# EAGLE design zumo_lidar_01 (EAGLE 9.5.2)
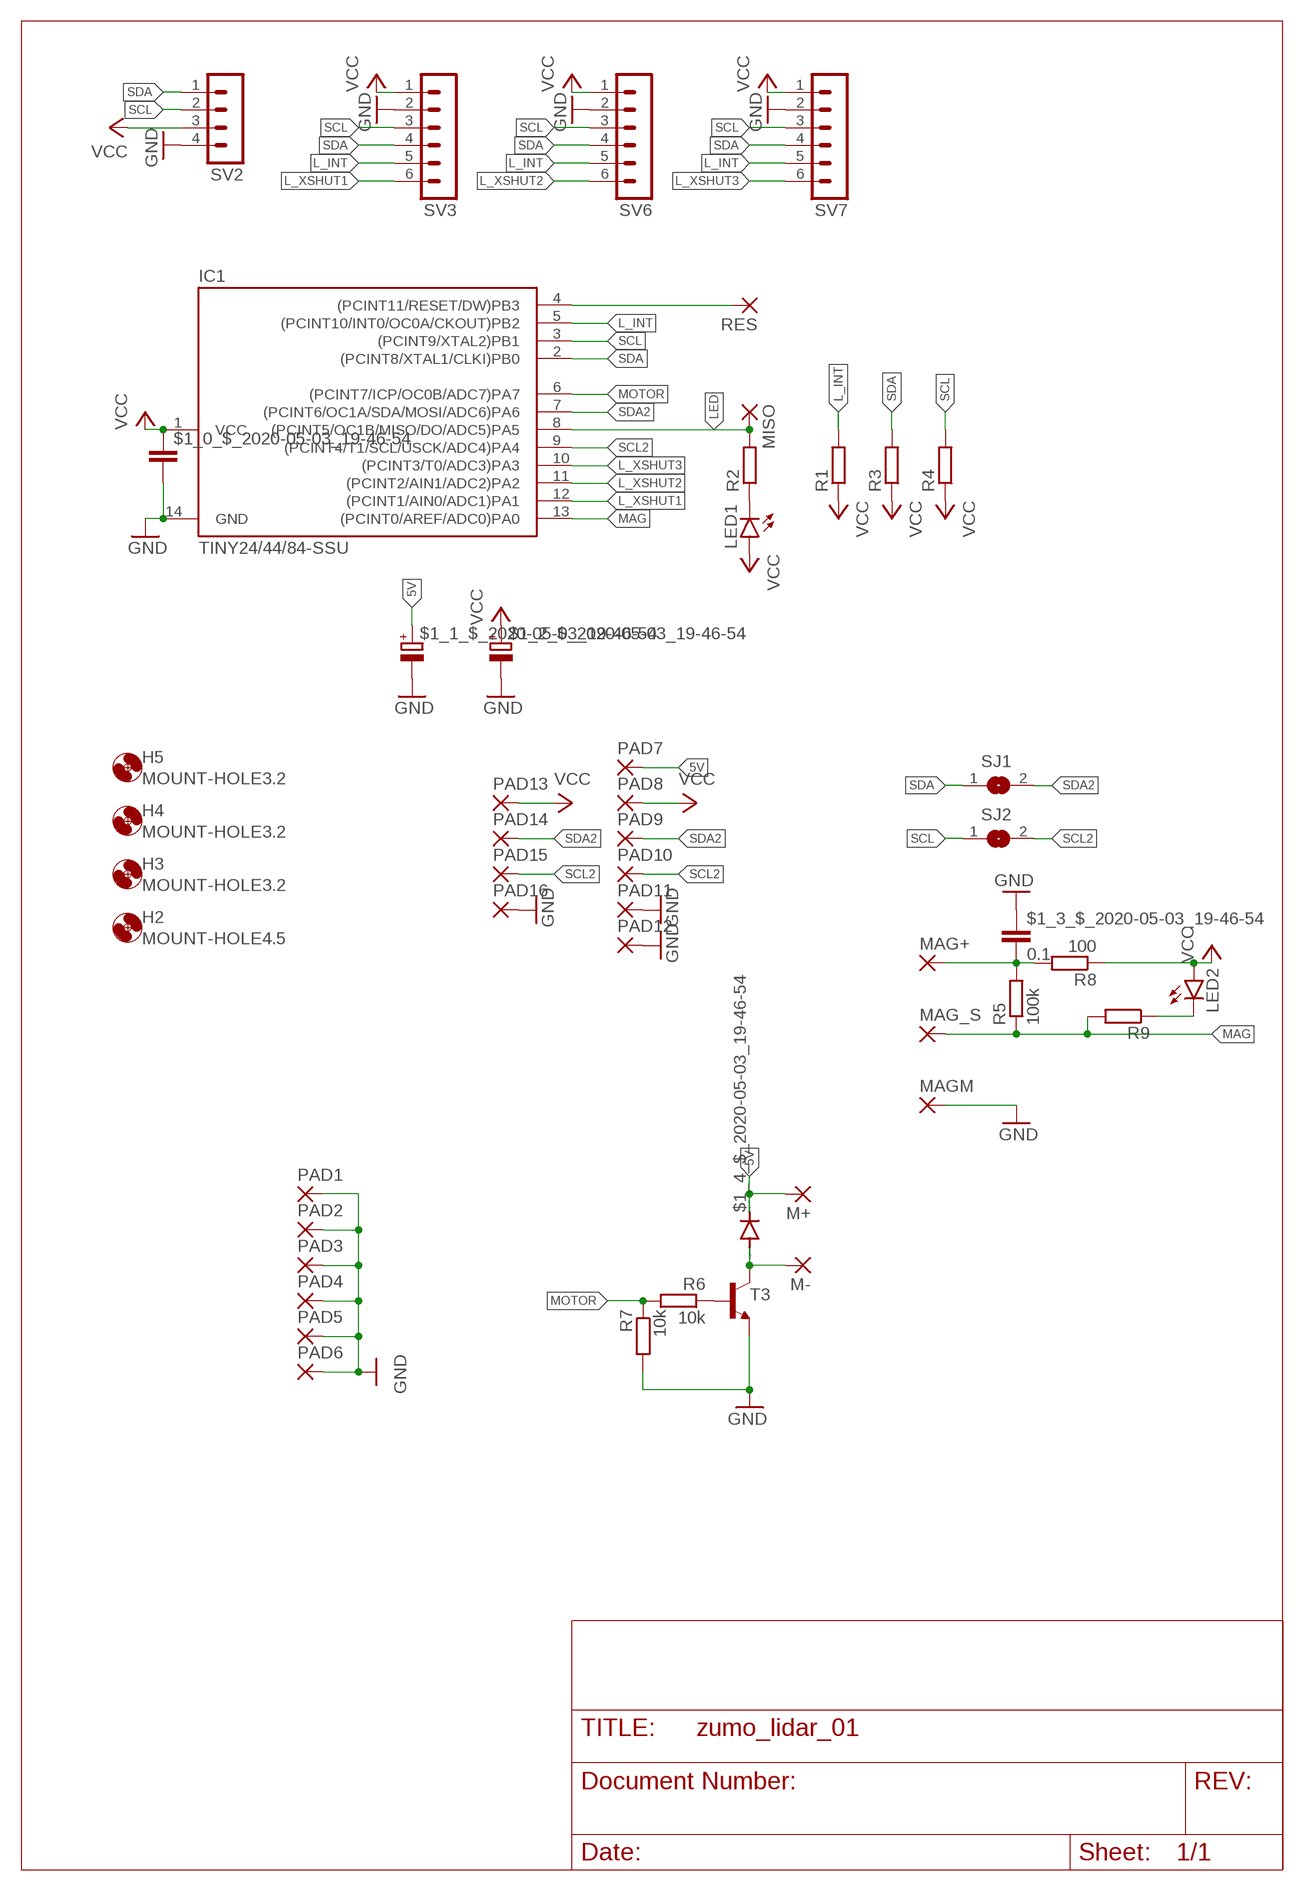
[diagram p0: schematic, sheet 1]

## Parts
$1_0_$_2020-05-03_19-46-54  C-EUC0805  [C0805]
$1_1_$_2020-05-03_19-46-54  CPOL-EUSMCC  [SMC_C]
$1_2_$_2020-05-03_19-46-54  CPOL-EUSMCC  [SMC_C]
$1_3_$_2020-05-03_19-46-54  0.1  C-EUC0805  [C0805]
$1_4_$_2020-05-03_19-46-54  DIODE-MINIMELF  [MINIMELF]
H2  MOUNT-HOLE4.5  [4,5]
H3  MOUNT-HOLE3.2  [3,2]
H4  MOUNT-HOLE3.2  [3,2]
H5  MOUNT-HOLE3.2  [3,2]
IC1  TINY24/44/84-SSU  [SOIC14]
LED1  LEDSML0805  [SML0805]
LED2  LEDSML0805  [SML0805]
M+  1,6/0,8  [1,6/0,8]
M-  1,6/0,8  [1,6/0,8]
MAG+  1,6/0,8  [1,6/0,8]
MAG_S  1,6/0,8  [1,6/0,8]
MAGM  1,6/0,8  [1,6/0,8]
MISO  1,6/0,8  [1,6/0,8]
PAD1  2,54/1,1  [2,54/1,1]
PAD2  2,54/1,1  [2,54/1,1]
PAD3  2,54/1,1  [2,54/1,1]
PAD4  2,54/1,1  [2,54/1,1]
PAD5  2,54/1,1  [2,54/1,1]
PAD6  2,54/1,1  [2,54/1,1]
PAD7  1,6/0,8  [1,6/0,8]
PAD8  1,6/0,8  [1,6/0,8]
PAD9  1,6/0,8  [1,6/0,8]
PAD10  1,6/0,8  [1,6/0,8]
PAD11  1,6/0,8  [1,6/0,8]
PAD12  1,6/0,8  [1,6/0,8]
PAD13  1,6/0,8  [1,6/0,8]
PAD14  1,6/0,8  [1,6/0,8]
PAD15  1,6/0,8  [1,6/0,8]
PAD16  1,6/0,8  [1,6/0,8]
R1  R-EU_M0805  [M0805]
R2  R-EU_M0805  [M0805]
R3  R-EU_M0805  [M0805]
R4  R-EU_M0805  [M0805]
R5  100k  R-EU_M0805  [M0805]
R6  10k  R-EU_R0805  [R0805]
R7  10k  R-EU_R0805  [R0805]
R8  100  R-EU_M0805  [M0805]
R9  R-EU_M0805  [M0805]
RES  1,6/0,8  [1,6/0,8]
SJ1  SJ  [SJ]
SJ2  SJ  [SJ]
SV2  MA04-1  [MA04-1]
SV3  MA06-1  [MA06-1]
SV6  MA06-1  [MA06-1]
SV7  MA06-1  [MA06-1]
T3  BC817-16-NPN-SOT23-BEC  [SOT23-BEC]

## Nets
5V: $1_1_$_2020-05-03_19-46-54.+ $1_4_$_2020-05-03_19-46-54.C M+.1(P) PAD7.1(P)
GND [gnd]: $1_0_$_2020-05-03_19-46-54.2 $1_1_$_2020-05-03_19-46-54.- $1_2_$_2020-05-03_19-46-54.- $1_3_$_2020-05-03_19-46-54.1 IC1.14(GND) MAGM.1(P) PAD1.1(P) PAD2.1(P) PAD3.1(P) PAD4.1(P) PAD5.1(P) PAD6.1(P) PAD11.1(P) PAD12.1(P) PAD16.1(P) R7.2 SV2.4 SV3.2 SV6.2 SV7.2 T3.E
L_INT: IC1.5((PCINT10/INT0/OC0A/CKOUT)PB2) R1.2 SV3.5 SV6.5 SV7.5
L_XSHUT1: IC1.12((PCINT1/AIN0/ADC1)PA1) SV3.6
L_XSHUT2: IC1.11((PCINT2/AIN1/ADC2)PA2) SV6.6
L_XSHUT3: IC1.10((PCINT3/T0/ADC3)PA3) SV7.6
LED: IC1.8((PCINT5/OC1B/MISO/DO/ADC5)PA5) MISO.1(P) R2.2
MAG: IC1.13((PCINT0/AREF/ADC0)PA0) MAG_S.1(P) R5.1 R9.2
MAGVCC: $1_3_$_2020-05-03_19-46-54.2 MAG+.1(P) R5.2 R8.2
MOTOR: IC1.6((PCINT7/ICP/OC0B/ADC7)PA7) R6.2 R7.1
N$1: LED1.C R2.1
N$2: $1_4_$_2020-05-03_19-46-54.A M-.1(P) T3.C
N$3: R6.1 T3.B
N$4: LED2.C R9.1
RESET: IC1.4((PCINT11/RESET/DW)PB3) RES.1(P)
SCL: IC1.3((PCINT9/XTAL2)PB1) R4.2 SJ2.1 SV2.2 SV3.3 SV6.3 SV7.3
SCL2: IC1.9((PCINT4/T1/SCL/USCK/ADC4)PA4) PAD10.1(P) PAD15.1(P) SJ2.2
SDA: IC1.2((PCINT8/XTAL1/CLKI)PB0) R3.2 SJ1.1 SV2.1 SV3.4 SV6.4 SV7.4
SDA2: IC1.7((PCINT6/OC1A/SDA/MOSI/ADC6)PA6) PAD9.1(P) PAD14.1(P) SJ1.2
VCC: $1_0_$_2020-05-03_19-46-54.1 $1_2_$_2020-05-03_19-46-54.+ IC1.1(VCC) LED1.A LED2.A PAD8.1(P) PAD13.1(P) R1.1 R3.1 R4.1 R8.1 SV2.3 SV3.1 SV6.1 SV7.1

## Library data of the parts
$1_0_$_2020-05-03_19-46-54 $1_3_$_2020-05-03_19-46-54 = rcl:C-EU: CAPACITOR, European symbol; SPICEPREFIX: C
$1_1_$_2020-05-03_19-46-54 $1_2_$_2020-05-03_19-46-54 = rcl:CPOL-EU: POLARIZED CAPACITOR, European symbol; SPICEPREFIX: C
$1_4_$_2020-05-03_19-46-54 = diode:DIODE-: DIODE
H2-H5 = holes:MOUNT-HOLE: MOUNTING HOLE with drill center marker
IC1 = avr-7:TINY24/44/84
LED1 LED2 = led:LED: LED OSRAM: - CHIPLED LG R971, LG N971, LY N971, LG Q971, LY Q971, LO R971, LY R971 LH N974, LH R974 LS Q976, LO Q976, LY Q976 LO Q996 - Hyper CHIPLED LW Q18S LB Q993, LB Q99A, LB R99A - SideLED LS A670, LO A670, LY A670, LG A670, LP A670 LB A673, LV A673, LT A673, LW A673 LH A674 LY A675 LS A676, LA A676, LO A676, LY A676, LW A676 LS A679, LY A679, LG A679 - Hyper Micro SIDELED® LS Y876, LA Y876, LO Y876, LY Y876 LT Y87S - SmartLED LW L88C, LW L88S LB L89C, LB L89S, LG L890 LS L89K, LO L89K, LY L89K LS L896, LA L896, LO L896, LY L896 - TOPLED LS T670, LO T670, LY T670, LG T670, LP T670 LSG T670, LSP T670, LSY T670, LOP T670, LYG T670 LG T671, LOG T671, LSG T671 LB T673, LV T673, LT T673, LW T673 LH T674 LS T676, LA T676, LO T676, LY T676, LB T676, LH T676, LSB T676, LW T676 LB T67C, LV T67C, LT T67C, LS T67K, LO T67K, LY T67K, LW E67C LS E67B, LA E67B, LO E67B, LY E67B, LB E67C, LV E67C, LT E67C LW T67C LS T679, LY T679, LG T679 LS T770, LO T770, LY T770, LG T770, LP T770 LB T773, LV T773, LT T773, LW T773 LH T774 LS E675, LA E675, LY E675, LS T675 LS T776, LA T776, LO T776, LY T776, LB T776 LHGB T686 LT T68C, LB T68C - Hyper Mini TOPLED® LB M676 - Mini TOPLED Santana® LG M470 LS M47K, LO M47K, LY M47K Source: http://www.osram.convergy.de LUXEON: - LUMILED® LXK2-PW12-R00, LXK2-PW12-S00, LXK2-PW14-U00, LXK2-PW14-V00 LXK2-PM12-R00, LXK2-PM12-S00, LXK2-PM14-U00 LXK2-PE12-Q00, LXK2-PE12-R00, LXK2-PE12-S00, LXK2-PE14-T00, LXK2-PE14-U00 LXK2-PB12-K00, LXK2-PB12-L00, LXK2-PB12-M00, LXK2-PB14-N00, LXK2-PB14-P00, LXK2-PB14-Q00 LXK2-PR12-L00, LXK2-PR12-M00, LXK2-PR14-Q00, LXK2-PR14-R00 LXK2-PD12-Q00, LXK2-PD12-R00, LXK2-PD12-S00 LXK2-PH12-R00, LXK2-PH12-S00 LXK2-PL12-P00, LXK2-PL12-Q00, LXK2-PL12-R00 Source: www.luxeon.com KINGBRIGHT: KA-3528ASYC Source: www.kingbright.com
M+ M- MAG+ MAG_S MAGM MISO PAD7-PAD16 RES = wirepad:1,6/0,8: THROUGH-HOLE PAD
PAD1-PAD6 = wirepad:2,54/1,1: THROUGH-HOLE PAD
R1-R5 R8 R9 = rcl:R-EU_: RESISTOR, European symbol; SPICEPREFIX: R
R6 R7 = rcl:R-EU_: RESISTOR, European symbol
SJ1 SJ2 = jumper:SJ: SMD solder JUMPER
SV2 = con-lstb:MA04-1: PIN HEADER; OC_FARNELL: unknown; OC_NEWARK: unknown
SV3 SV6 SV7 = con-lstb:MA06-1: PIN HEADER; OC_FARNELL: unknown; OC_NEWARK: unknown
T3 = transistor:*-NPN-: NPN Transistror BF959 corrected 2008.03.06

## Net classes
1 gnd: width 0.381 mm, drill 0.381 mm
2 power: width 0.381 mm, drill 0.381 mm

## Board
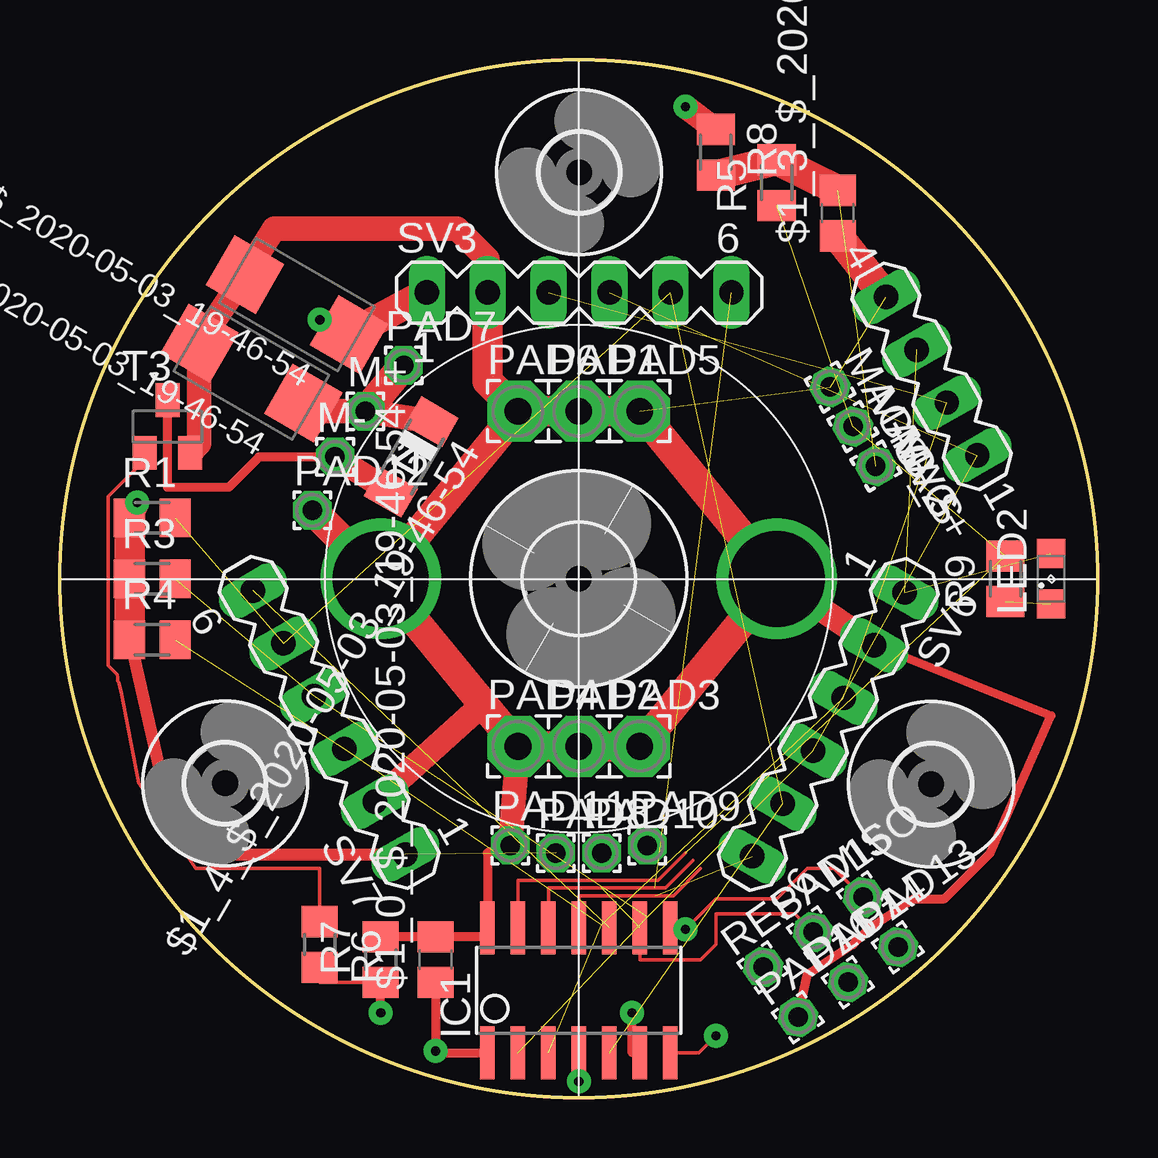
[diagram p1: board, top side]
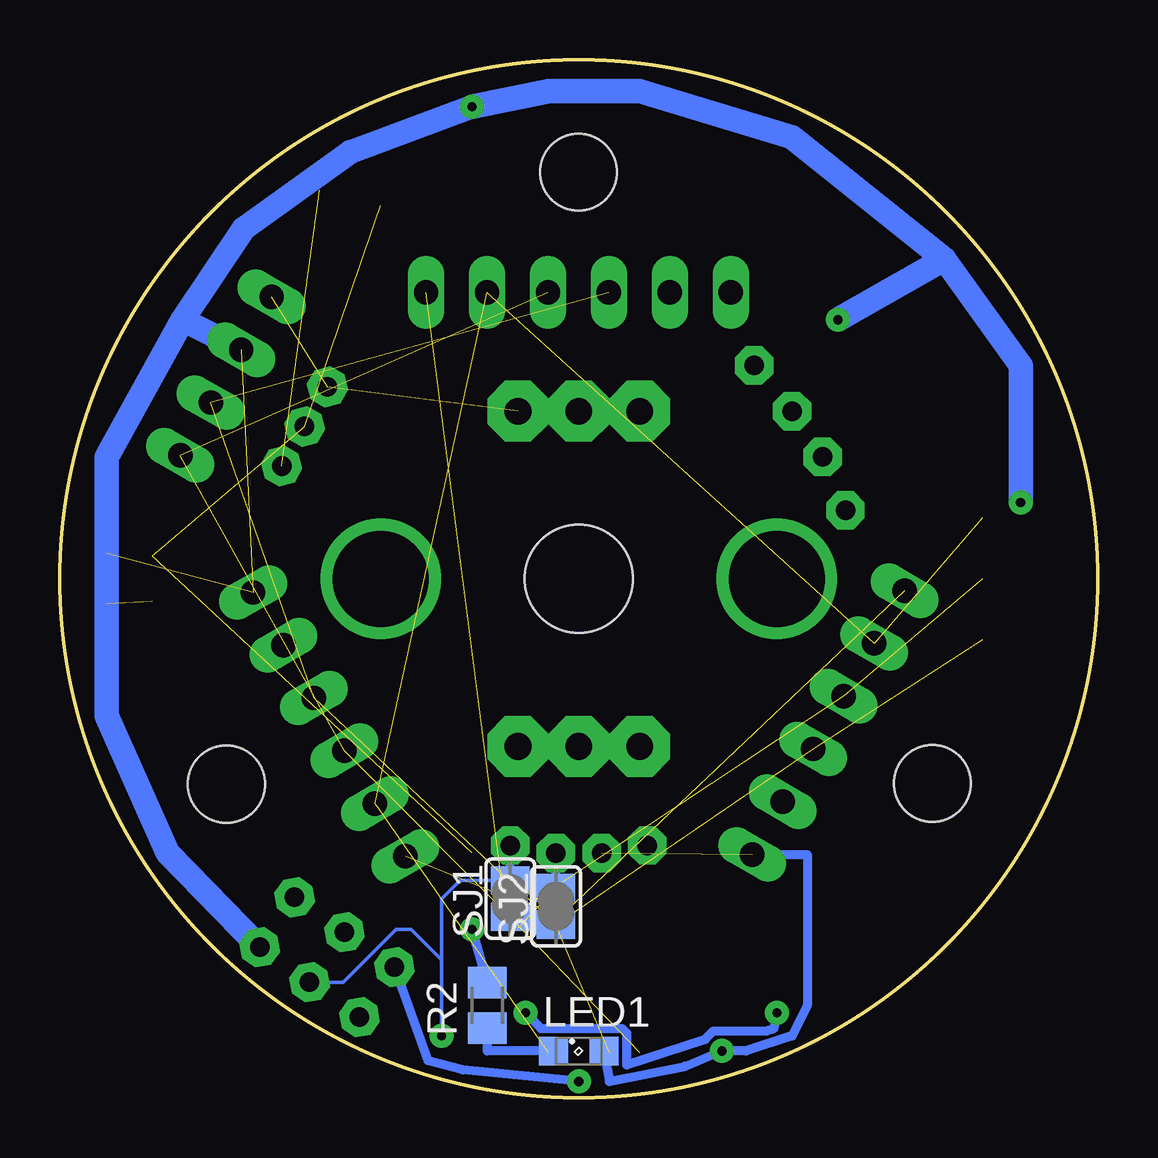
[diagram p2: board, bottom side, seen from below]

Size 43.25 x 43.25 mm. Coordinates in mm from the lower left corner, seen from the top.
Outline: circle at 21.63,21.63 radius 21.63
Copper layers (1*16): Top 0.035mm / dielectric 1.5mm / Bottom 0.035mm
Design rules "eagle": minimum track width 5mil, minimum drill 12mil, track to track 6mil, track to pad 6mil, pad to pad 6mil, via to via 6mil, smd to smd 0mil, copper to edge 10mil, drill to drill 10mil, minimum pad ring 10mil, minimum via ring 6mil, stop-mask expansion 2mil, vias tented up to drill 25mil, thermal gap 10mil

### Footprints (pad centres in the part's own frame; a part is rotated, then mirrored left to right if it is on the bottom)
C0805 = smd 1.3 x 1.5: 1 -0.95,0; 2 0.95,0
SMC_C = smd 2.4 x 2.4: + -2.5,0; - 2.5,0
MINIMELF = smd 1.4 x 1.8: A 1.7,0; C -1.7,0
4,5 = hole 4.5: 0,0
3,2 = hole 3.2: 0,0
SOIC14 = smd 0.61 x 2.21: 1 -3.81,-2.603; 2 -2.54,-2.603; 3 -1.27,-2.603; 4 0,-2.603; 5 1.27,-2.603; 6 2.54,-2.603; 7 3.81,-2.603; 8 3.81,2.603; 9 2.54,2.603; 10 1.27,2.603; 11 0,2.603; 12 -1.27,2.603; 13 -2.54,2.603; 14 -3.81,2.603
SML0805 = smd 1.2 x 1.2: A 1.05,0; C -1.05,0
1,6/0,8 = drill 0.813 pad 1.6 octagon: 1 0,0
2,54/1,1 = drill 1.118 pad 2.54 octagon: 1 0,0
M0805 = smd 1.3 x 1.6: 1 -0.95,0; 2 0.95,0
R0805 = smd 1.3 x 1.5: 1 -0.95,0; 2 0.95,0
SJ = smd 1.168 x 1.6: 1 -0.762,0; 2 0.762,0
MA04-1 = drill 1.016 long: 1 -3.81,0; 2 -1.27,0; 3 1.27,0; 4 3.81,0
MA06-1 = drill 1.016 long: 1 -6.35,0; 2 -3.81,0; 3 -1.27,0; 4 1.27,0; 5 3.81,0; 6 6.35,0
SOT23-BEC = smd 1 x 1.4: B -0.95,-1.1; C 0,1.1; E 0.95,-1.1

### Placement (x,y rotation side)
$1_0_$_2020-05-03_19-46-54  15.66,5.75 90 top
$1_1_$_2020-05-03_19-46-54  7.97,30.2 150 top
$1_2_$_2020-05-03_19-46-54  9.88,33.06 150 top
$1_3_$_2020-05-03_19-46-54  32.42,36.87 90 top
$1_4_$_2020-05-03_19-46-54  14.64,26.71 240 top
H2  21.63,21.63 60 top
H3  21.64,38.57 0 top
H4  36.32,13.07 0 top
H5  6.88,13.1 0 top
IC1  21.63,4.48 0 top
LED1  21.63,1.94 0 bottom
LED2  41.31,21.63 90 top
M+  12.74,28.61 0 top
M-  11.47,26.71 0 top
MAG+  34.01,26.33 300 top
MAG_S  33.06,27.98 300 top
MAGM  32.1,29.63 300 top
MISO  33.47,8.35 35 top
PAD1  21.63,28.61 0 top
PAD2  21.63,14.64 0 top
PAD3  24.17,14.64 0 top
PAD4  19.09,14.64 0 top
PAD5  24.17,28.61 0 top
PAD6  19.09,28.61 0 top
PAD7  14.32,30.52 0 top
PAD8  20.67,10.2 0 top
PAD9  24.48,10.51 0 top
PAD10  22.58,10.2 0 top
PAD11  18.77,10.51 0 top
PAD12  10.51,24.48 0 top
PAD13  34.93,6.27 35 top
PAD14  32.85,4.81 35 top
PAD15  31.39,6.89 35 top
PAD16  30.77,3.36 35 top
R1  3.85,24.17 0 top
R2  25.44,3.85 90 bottom
R3  3.85,21.63 0 top
R4  3.85,19.09 0 top
R5  29.88,38.14 90 top
R6  10.83,6.39 270 top
R7  13.37,5.75 90 top
R8  27.34,39.41 270 top
R9  39.41,21.63 90 top
RES  29.31,5.44 35 top
SJ1  24.48,8.29 90 bottom
SJ2  22.58,7.97 90 bottom
SV2  36.34,30.07 120 top
SV3  21.64,33.56 0 top
SV6  32.03,15.56 240 top
SV7  11.22,15.64 120 top
T3  4.48,27.98 0 top

### Tracks (layer width: path | path; a pad name or v marks a point on that pad's centre or on a via)
5V
  Top 1.016: $1_1_$_2020-05-03_19-46-54.+ 10.48,28.61 M+.1 $1_4_$_2020-05-03_19-46-54.C
  Top 1.27: M+.1 PAD7.1
GND  (via drill 4)  (2 unrouted)
  Top 0.152: IC1.14 17.82,6.7
  Top 0.381: 17.82,6.7 $1_0_$_2020-05-03_19-46-54.2 R7.2 | PAD11.1 17.82,10.2 IC1.14 | PAD16.1 31.15,5.12 33.06,6.39 33.69,7.02 35.6,8.29 36.87,8.29 38.77,10.2 41.31,15.91 SV6.2
  Top 1.016: T3.E 5.81,27.25 $1_1_$_2020-05-03_19-46-54.- $1_2_$_2020-05-03_19-46-54.- 8.93,36.23 16.55,36.23 17.83,34.95 SV3.2 | v29.88,21.63 SV6.2 | SV7.2 17.64,16.41 | PAD11.1 PAD4.1
  Top 1.27: PAD6.1 PAD1.1 PAD5.1 v29.88,21.63 PAD3.1 PAD2.1 PAD4.1 | SV3.2 17.83,29.87 PAD6.1 | PAD4.1 18.77,14.32 | PAD6.1 v13.37,21.63 | PAD4.1 17.64,16.41 v13.37,21.63 | $1_3_$_2020-05-03_19-46-54.1 SV2.4 | PAD12.1 v13.37,21.63
L_INT  (4 unrouted)
L_XSHUT1  (1 unrouted)
  Top 0.15: IC1.12 20.36,8.74 24.8,8.74 25.25,8.74 26.39,9.88
L_XSHUT2  (1 unrouted)
  Top 0.15: IC1.11 21.63,8.42 24.8,8.42 25.56,8.42 26.71,9.56
L_XSHUT3  (1 unrouted)
LED  (via drill 0.38 pad 1)
  Top 0.15: v26.07,7.02 27.34,8.29 29.88,8.29 31.15,9.56 32.26,9.56 MISO.1
  Top 0.381: v26.07,7.02 IC1.8
  Bottom 0.381: R2.2 v26.07,7.02
MAG  (3 unrouted)
  Top 0.15: IC1.13 19.09,9.05 24.93,9.05 26.07,10.2
MAGVCC  (1 unrouted)
  Top 1.27: $1_3_$_2020-05-03_19-46-54.2 R5.2 R8.2
MOTOR  (via drill 0.38 pad 1)
  Top 0.152: R7.1 10.83,4.8 R6.2
  Top 0.381: IC1.6 23.85,1.88 v23.85,3.53 | v13.37,3.53 R7.1
  Bottom 0.381: v23.85,3.53 23.21,2.89 19.84,2.89 19.63,2.68 19.63,1.36 16.36,2.43 16.01,2.79 13.8,2.79 13.48,2.89 v13.37,3.53
N$1
  Bottom 0.381: LED1.C 25.44,1.94 R2.1
N$2
  Top 0.381: T3.C 4.48,25.44 7.02,25.44 8.29,26.71 M-.1
  Top 1.016: M-.1 $1_4_$_2020-05-03_19-46-54.A
N$3
  Top 0.152: T3.B 3.53,26.58 2.02,25.06 2.02,18.01 2.38,17.65 2.41,17.51 2.41,17.36 2.46,17.32 2.55,16.92 3.27,13.12 5.65,9.56 10.83,9.56 R6.1
N$4  (1 unrouted)
RESET  (via drill 0.38 pad 1)
  Top 0.381: IC1.4 v21.63,0.67
  Bottom 0.381: v21.63,0.67 26.47,1.16 27.91,1.54 RES.1
SCL  (6 unrouted)
SCL2  (1 unrouted)
  Top 0.15: IC1.9 24.17,5.75 26.71,5.75 27.34,6.39 27.34,7.66 30.63,7.66 PAD15.1
  Bottom 0.381: SJ2.2 PAD10.1
SDA  (6 unrouted)
SDA2  (via drill 0.38 pad 1)
  Top 0.15: v27.34,2.58 26.64,1.88 IC1.7
  Bottom 0.15: PAD14.1 31.46,4.81 29.25,7.02 28.61,7.02 27.34,5.75 | 27.34,5.75 v27.34,2.58 | SJ1.2 26.58,9.05 27.34,8.29 27.34,5.75
  Bottom 0.381: SJ1.2 PAD9.1
VCC  (via drill 0.38 pad 1)  (3 unrouted)
  Top 0.381: $1_0_$_2020-05-03_19-46-54.1 v15.66,1.94 15.66,1.88 IC1.1
  Top 0.508: R4.1 2.95,19.03 4.49,12.25 5.9,10.14 SV7.1
  Top 1.016: R1.1 v3.21,24.8 | v10.83,32.42 $1_2_$_2020-05-03_19-46-54.+ | R8.1 v26.07,41.31
  Top 1.27: R4.1 R3.1 R1.1 | $1_2_$_2020-05-03_19-46-54.+ SV3.1
  Bottom 0.381: SV7.1 12.1,10.14 12.1,3.85 12.74,2.58 14.64,1.94 v15.66,1.94 17.18,1.31 20.36,0.67 LED1.A
  Bottom 1.016: v3.21,24.8 3.21,30.52 6.39,34.96 | 6.39,34.96 v10.83,32.42 | 6.39,34.96 12.74,40.04 19.09,41.95 22.9,41.95 v26.07,41.31 31.15,39.41 35.6,36.23 38.14,32.42 | SV2.3 38.14,32.42 | 38.14,32.42 41.31,26.71 41.31,15.91 38.77,10.2 PAD13.1